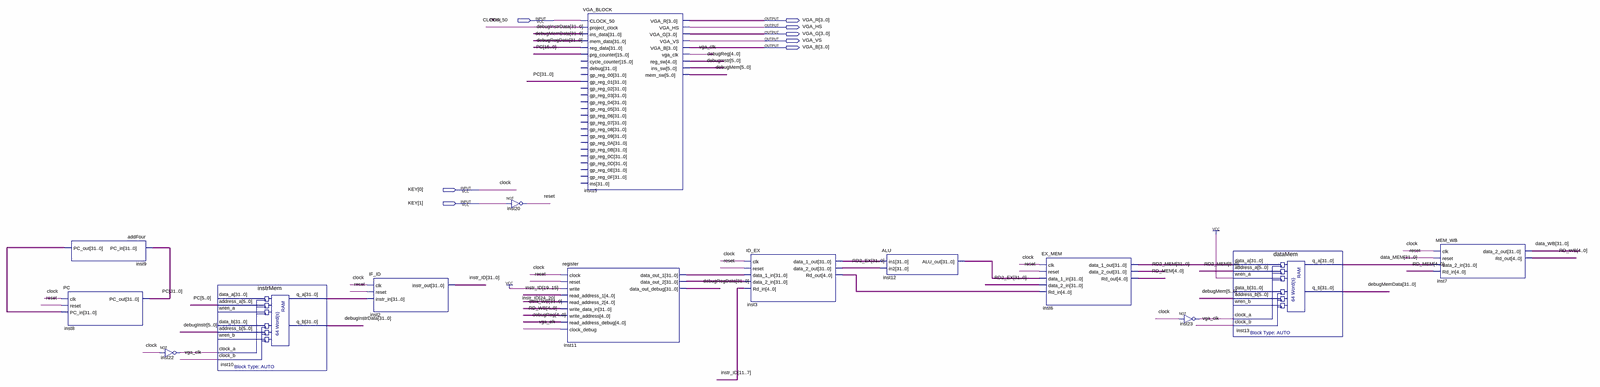
[diagram p0: schematic sheet, whole]
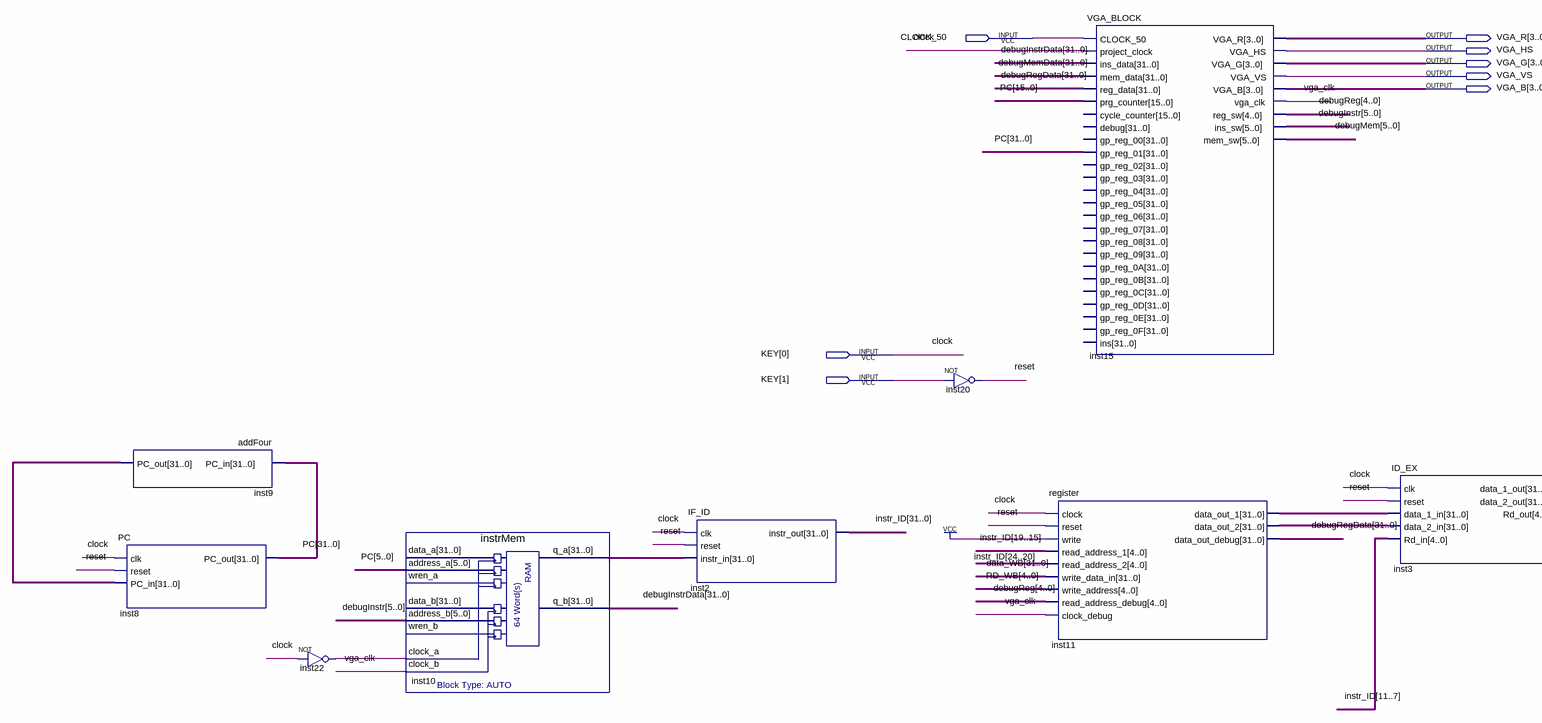
[diagram p1: schematic sheet, left part]
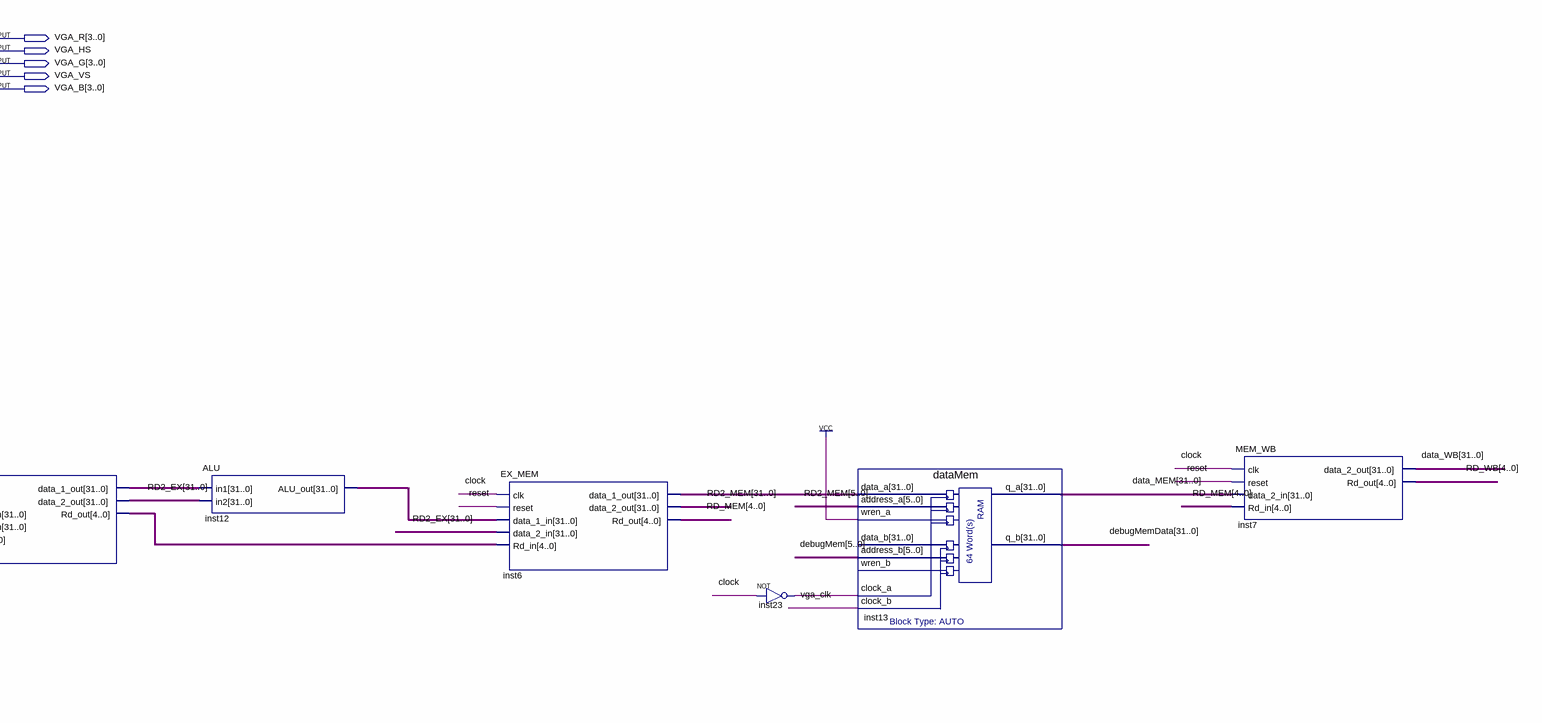
[diagram p2: schematic sheet, right part]
// Quartus schematic top.bdf as structural Verilog: 14 symbols, 8 pins
module top (
  input  CLOCK_50,
  input  [1:0] KEY,
  output [3:0] VGA_R,
  output VGA_HS,
  output [3:0] VGA_G,
  output VGA_VS,
  output [3:0] VGA_B
);

  wire inst22_out, inst23_out, reset, vga_clk;
  wire [4:0] debugReg, inst3_rd_out, RD_MEM, RD_WB;
  wire [5:0] debugInstr, debugMem;
  wire [31:0] data_MEM, data_WB, debugInstrData, debugMemData, debugRegData, inst3_data_1_out,
       inst6_data_1_out, inst9_pc_out, inst10_q_a, inst11_data_out_1, inst11_data_out_2, inst12_alu_out,
       instr_ID, PC, RD2_EX, RD2_MEM;

  addFour inst9 (.PC_in(PC), .PC_out(inst9_pc_out));
  PC inst8 (.clk(KEY[0]), .reset(reset), .PC_in(inst9_pc_out), .PC_out(PC));
  not inst22 (inst22_out, KEY[0]);
  instrMem inst10 (
    .address_a(PC[5:0]), .address_b(debugInstr), .clock_a(inst22_out), .clock_b(vga_clk), .q_a(inst10_q_a),
    .q_b(debugInstrData));  // open: data_a, wren_a, data_b, wren_b
  IF_ID inst2 (.clk(KEY[0]), .reset(reset), .instr_in(inst10_q_a), .instr_out(instr_ID));
  not inst20 (reset, KEY[1]);
  register inst11 (
    .clock(KEY[0]), .reset(reset), .write(1'b1), .read_address_1(instr_ID[19:15]),
    .read_address_2(instr_ID[24:20]), .write_data_in(data_WB), .write_address(RD_WB),
    .read_address_debug(debugReg), .clock_debug(vga_clk), .data_out_1(inst11_data_out_1),
    .data_out_2(inst11_data_out_2), .data_out_debug(debugRegData));
  VGA_BLOCK inst15 (
    .CLOCK_50(CLOCK_50), .project_clock(KEY[0]), .ins_data(debugInstrData), .mem_data(debugMemData),
    .reg_data(debugRegData), .prg_counter(PC[15:0]), .gp_reg_01(PC), .VGA_R(VGA_R), .VGA_HS(VGA_HS),
    .VGA_G(VGA_G), .VGA_VS(VGA_VS), .VGA_B(VGA_B), .vga_clk(vga_clk), .reg_sw(debugReg), .ins_sw(debugInstr),
    .mem_sw(debugMem));  // open: cycle_counter, debug, gp_reg_00, gp_reg_02, gp_reg_03, gp_reg_04, gp_reg_05, gp_reg_06, gp_reg_07, gp_reg_08, gp_reg_09, gp_reg_0A, gp_reg_0B, gp_reg_0C, gp_reg_0D, gp_reg_0E, gp_reg_0F, ins
  ID_EX inst3 (
    .clk(KEY[0]), .reset(reset), .data_1_in(inst11_data_out_1), .data_2_in(inst11_data_out_2),
    .Rd_in(instr_ID[11:7]), .data_1_out(inst3_data_1_out), .data_2_out(RD2_EX), .Rd_out(inst3_rd_out));
  ALU inst12 (.in1(inst3_data_1_out), .in2(RD2_EX), .ALU_out(inst12_alu_out));
  EX_MEM inst6 (
    .clk(KEY[0]), .reset(reset), .data_1_in(inst12_alu_out), .data_2_in(RD2_EX), .Rd_in(inst3_rd_out),
    .data_1_out(inst6_data_1_out), .data_2_out(RD2_MEM), .Rd_out(RD_MEM));
  not inst23 (inst23_out, KEY[0]);
  dataMem inst13 (
    .data_a(inst6_data_1_out), .address_a(RD2_MEM[5:0]), .wren_a(1'b1), .address_b(debugMem),
    .clock_a(inst23_out), .clock_b(vga_clk), .q_a(data_MEM), .q_b(debugMemData));  // open: data_b, wren_b
  MEM_WB inst7 (
    .clk(KEY[0]), .reset(reset), .data_2_in(data_MEM), .Rd_in(RD_MEM), .data_2_out(data_WB), .Rd_out(RD_WB));

  // Other names for the same wires on the sheet: clock = KEY[0]
endmodule
